# EAGLE design ROB v2 (EAGLE 9.6.2)
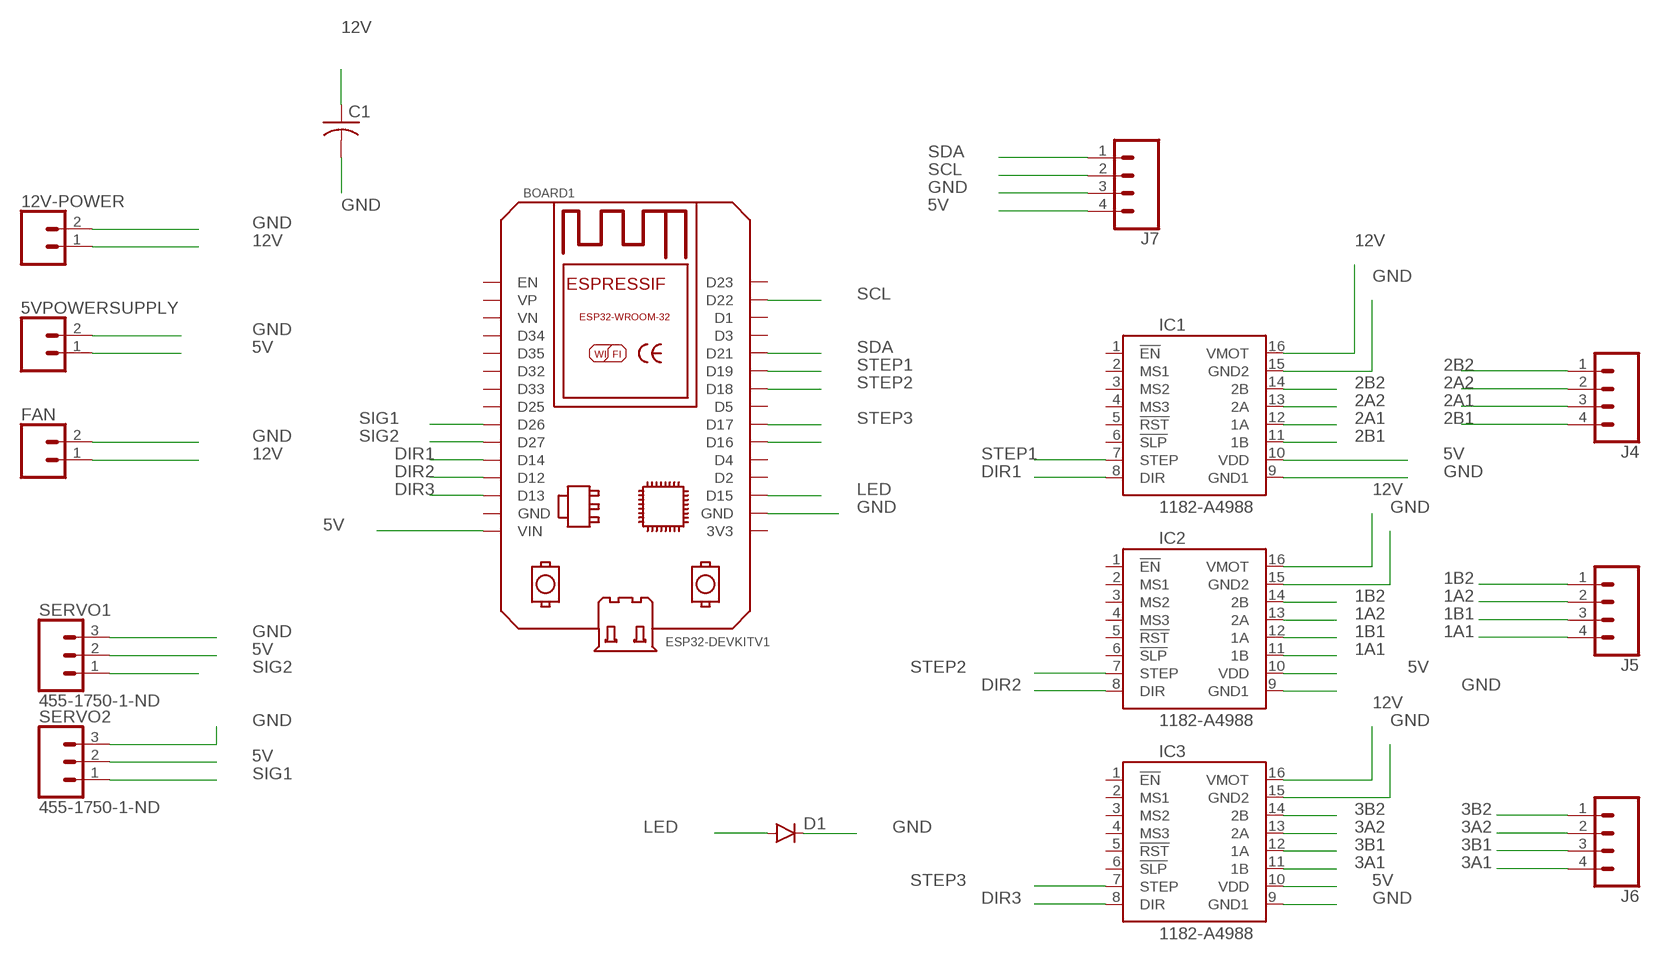
[diagram p0: schematic, sheet 1]

## Parts
5VPOWERSUPPLY  CONN_02  [1X02]
12V-POWER  CONN_02  [1X02]
BOARD1  ESP32DEVKITV1  [ESP32-DEVKITV1]
C1  C-US050-075X075  [C050-075X075]
D1  DIODE  [DIODE-1N4001-KIT]
FAN  CONN_02  [1X02]
IC1  1182-A4988  [A4988]
IC2  1182-A4988  [A4988]
IC3  1182-A4988  [A4988]
J4  CONN_04LONGPADS  [1X04_LONGPADS]
J5  CONN_04LONGPADS  [1X04_LONGPADS]
J6  CONN_04LONGPADS  [1X04_LONGPADS]
J7  CONN_04LOCK  [1X04_LOCK]
SERVO1  455-1750-1-ND  CONN_03  [1X03]
SERVO2  455-1750-1-ND  CONN_03  [1X03]

## Nets
1A1: IC2.11(1B) J5.4
1A2: IC2.13(2A) J5.2
1B1: IC2.12(1A) J5.3
1B2: IC2.14(2B) J5.1
2A1: IC1.12(1A) J4.3
2A2: IC1.13(2A) J4.2
2B1: IC1.11(1B) J4.4
2B2: IC1.14(2B) J4.1
3A1: IC3.11(1B) J6.4
3A2: IC3.13(2A) J6.2
3B1: IC3.12(1A) J6.3
3B2: IC3.14(2B) J6.1
5V: 5VPOWERSUPPLY.1 BOARD1.VIN IC1.10(VDD) IC2.10(VDD) IC3.10(VDD) J7.4 SERVO1.2 SERVO2.2
12V: 12V-POWER.1 C1.1 FAN.1 IC1.16(VMOT) IC2.16(VMOT) IC3.16(VMOT)
DIR1: BOARD1.D14 IC1.8(DIR)
DIR2: BOARD1.D12 IC2.8(DIR)
DIR3: BOARD1.D13 IC3.8(DIR)
GND: 5VPOWERSUPPLY.2 12V-POWER.2 BOARD1.GND@1(GND) C1.2 D1.C FAN.2 IC1.9(GND1) IC1.15(GND2) IC2.9(GND1) IC2.15(GND2) IC3.9(GND1) IC3.15(GND2) J7.3 SERVO1.3 SERVO2.3
LED: BOARD1.D15 D1.A
N$3: BOARD1.D16
SCL: BOARD1.D22 J7.2
SDA: BOARD1.D21 J7.1
SIG1: BOARD1.D26 SERVO2.1
SIG2: BOARD1.D27 SERVO1.1
STEP1: BOARD1.D19 IC1.7(STEP)
STEP2: BOARD1.D18 IC2.7(STEP)
STEP3: BOARD1.D17 IC3.7(STEP)
Unconnected: BOARD1.3V3 BOARD1.D1 BOARD1.D2 BOARD1.D3 BOARD1.D4 BOARD1.D5 BOARD1.D23 BOARD1.D25 BOARD1.D32 BOARD1.D33 BOARD1.D34 BOARD1.D35 BOARD1.EN BOARD1.GND BOARD1.VN BOARD1.VP IC1.1(!EN) IC1.2(MS1) IC1.3(MS2) IC1.4(MS3) IC1.5(!RST) IC1.6(!SLP) IC2.1(!EN) IC2.2(MS1) IC2.3(MS2) IC2.4(MS3) IC2.5(!RST) IC2.6(!SLP) IC3.1(!EN) IC3.2(MS1) IC3.3(MS2) IC3.4(MS3) IC3.5(!RST) IC3.6(!SLP)

## Library data of the parts
5VPOWERSUPPLY 12V-POWER FAN = SparkFun-Connectors:CONN_02: Multi connection point. Often used as Generic Header-pin footprint for 0.1 inch spaced/style header connections On any of the 0.1 inch spaced packages, you can populate with these: Break Away Headers - Straight <https://www.sparkfun.com/products/116> (PRT-00116) Break Away Male Headers - Right Angle <https://www.sparkfun.com/products/553> (PRT-00553) Female Headers <https://www.sparkfun.com/products/115> (PRT-00115) Break Away Headers - Machine Pin <https://www.sparkfun.com/products/117> (PRT-00117) Break Away Female Headers - Swiss Machine Pin <https://www.sparkfun.com/products/743> (PRT-00743) For SCREWTERMINALS and SPRING TERMINALS visit here: Screw Terimnals on SparkFun.com <https://www.sparkfun.com/search/results?term=Screw+Terminals> (5mm/3.5mm/2.54mm spacing) This device is also useful as a general connection point to wire up your design to another part of your project. Our various solder wires solder well into these plated through hole pads. Hook-Up Wire - Assortment (Stranded, 22 AWG) <https://www.sparkfun.com/products/11375> (PRT-11375) Hook-Up Wire - Assortment (Solid Core, 22 AWG) <https://www.sparkfun.com/products/11367> (PRT-11367) View the entire wire category on our website here <https://www.sparkfun.com/categories/141> Special notes: Molex polarized connector foot print use with: PRT-08233 with associated crimp pins and housings. 2.54_SCREWTERM for use with PRT-10571. 3.5mm Screw Terminal footprints for PRT-08084 5mm Screw Terminal footprints for use with PRT-08432
BOARD1 = ESP32-DEVKITV1:ESP32DEVKITV1: https://github.com/shridattdudhat
C1 = BeagleBone_Black_Wireless:C-US: CAPACITOR, American symbol
D1 = BeagleBone_Blue_R3:DIODE: Diode These are standard reverse protection diodes and small signal diodes. SMA package can handle up to about 1A. SOD-323 can handle about 200mA. What the SOD-323 package when ordering, there are some mfgs out there that are 5-pin packages.
IC1-IC3 = pololu-stepper-driver:1182-A4988: A4988 Stepper Motor Driver Carrier #1182 A4988 Stepper Motor Driver Carrier <https://www.pololu.com/product/1182> in Japan, Suzaku Lab. Ltd. <https://suzakugiken.jp/> #1182 A4988ステッピングモータドライバ <https://szc.jp/po1182>
J4-J7 = SparkFun-Connectors:CONN_04: Multi connection point. Often used as Generic Header-pin footprint for 0.1 inch spaced/style header connections On any of the 0.1 inch spaced packages, you can populate with these: Break Away Headers - Straight <https://www.sparkfun.com/products/116> (PRT-00116) Break Away Male Headers - Right Angle <https://www.sparkfun.com/products/553> (PRT-00553) Female Headers <https://www.sparkfun.com/products/115> (PRT-00115) Break Away Headers - Machine Pin <https://www.sparkfun.com/products/117> (PRT-00117) Break Away Female Headers - Swiss Machine Pin <https://www.sparkfun.com/products/743> (PRT-00743) For SCREWTERMINALS and SPRING TERMINALS visit here: Screw Terimnals on SparkFun.com <https://www.sparkfun.com/search/results?term=Screw+Terminals> (5mm/3.5mm/2.54mm spacing) This device is also useful as a general connection point to wire up your design to another part of your project. Our various solder wires solder well into these plated through hole pads. Hook-Up Wire - Assortment (Stranded, 22 AWG) <https://www.sparkfun.com/products/11375> (PRT-11375) Hook-Up Wire - Assortment (Solid Core, 22 AWG) <https://www.sparkfun.com/products/11367> (PRT-11367) View the entire wire category on our website here <https://www.sparkfun.com/categories/141> Special notes: Molex polarized connector foot print use with SKU : PRT-08231 with associated crimp pins and housings. 1MM SMD Version SKU: PRT-10208; PROD_ID: CONN-09696
SERVO1 SERVO2 = SparkFun-Connectors:CONN_03: Multi connection point. Often used as Generic Header-pin footprint for 0.1 inch spaced/style header connections On any of the 0.1 inch spaced packages, you can populate with these: Break Away Headers - Straight <https://www.sparkfun.com/products/116> (PRT-00116) Break Away Male Headers - Right Angle <https://www.sparkfun.com/products/553> (PRT-00553) Female Headers <https://www.sparkfun.com/products/115> (PRT-00115) Break Away Headers - Machine Pin <https://www.sparkfun.com/products/117> (PRT-00117) Break Away Female Headers - Swiss Machine Pin <https://www.sparkfun.com/products/743> (PRT-00743) Stackable Header - 3 Pin (Female, 0.1") <https://www.sparkfun.com/products/13875> (PRT-13875) For SCREWTERMINALS and SPRING TERMINALS visit here: Screw Terimnals on SparkFun.com <https://www.sparkfun.com/search/results?term=Screw+Terminals> (5mm/3.5mm/2.54mm spacing) This device is also useful as a general connection point to wire up your design to another part of your project. Our various solder wires solder well into these plated through hole pads. Hook-Up Wire - Assortment (Stranded, 22 AWG) <https://www.sparkfun.com/products/11375> (PRT-11375) Hook-Up Wire - Assortment (Solid Core, 22 AWG) <https://www.sparkfun.com/products/11367> (PRT-11367) View the entire wire category on our website here <https://www.sparkfun.com/categories/141> Special notes: Molex polarized connector foot print use with SKU : PRT-08232 with associated crimp pins and housings.; PROD_ID: XXX-00000

## Board
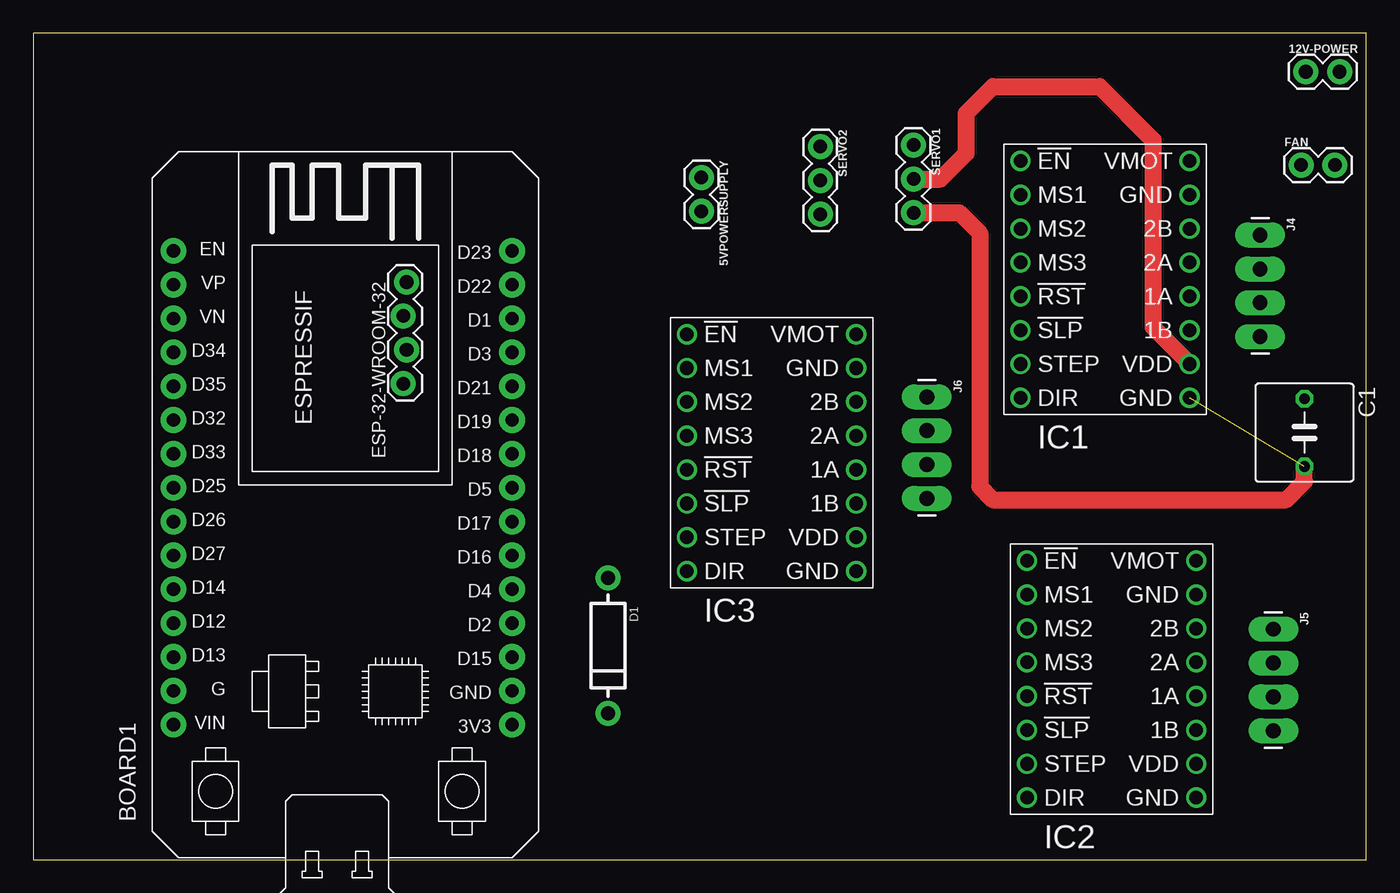
[diagram p1: board, top side]
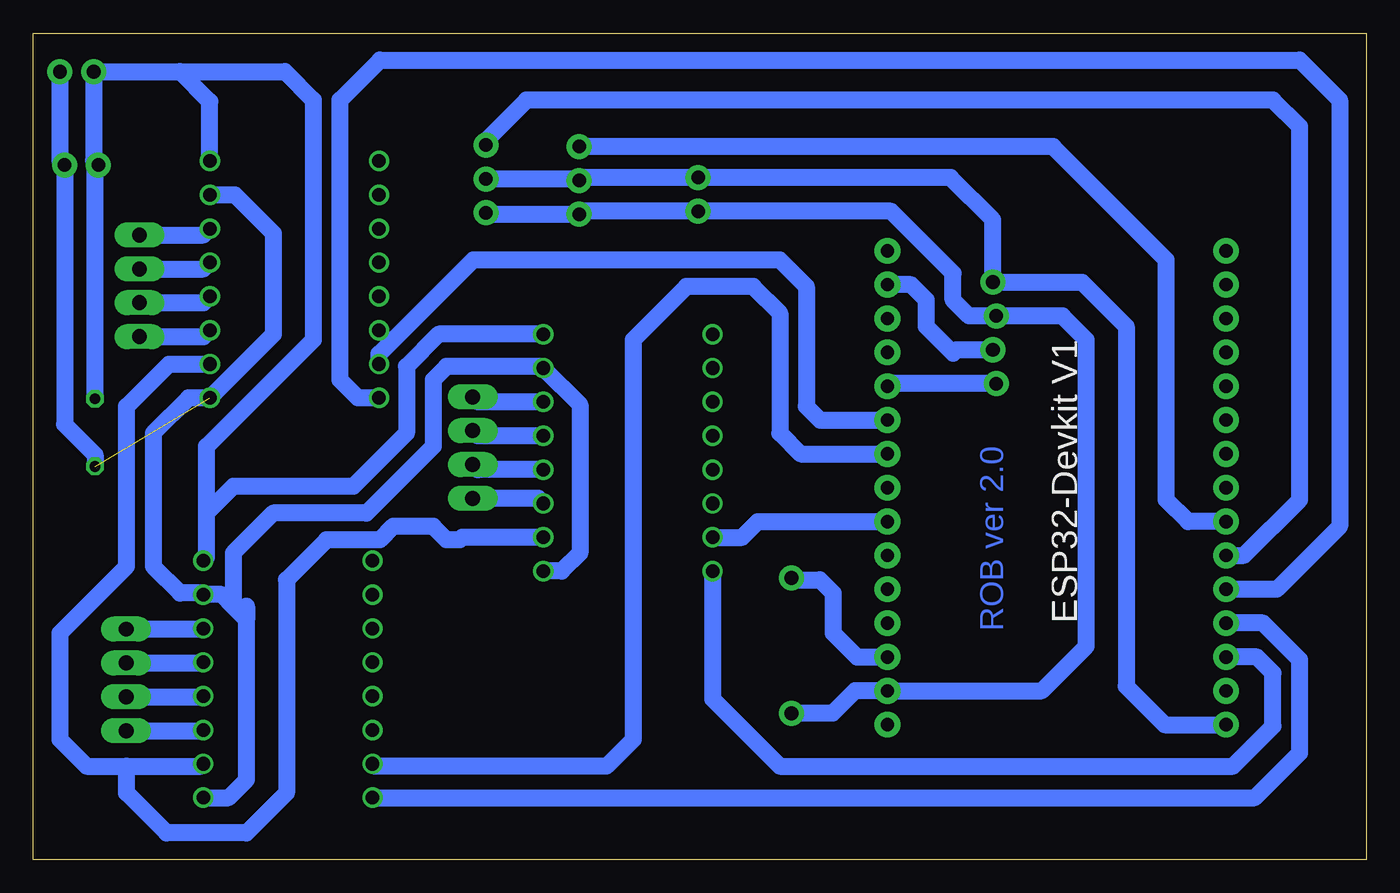
[diagram p2: board, bottom side, seen from below]

Size 100 x 62 mm. Coordinates in mm from the lower left corner, seen from the top.
Outline: 0,0 100,0 100,62 0,62 0,0
Copper layers (1*16): Top 0.035mm / dielectric 1.5mm / Bottom 0.035mm
Design rules "default": minimum track width 6mil, minimum drill 0.35mm, track to track 6mil, track to pad 6mil, pad to pad 6mil, via to via 6mil, smd to smd 6mil, copper to edge 40mil, drill to drill 6mil, minimum pad ring 10mil, minimum via ring 8mil, stop-mask expansion 4mil, vias tented up to drill 0mil, thermal gap 10mil

### Footprints (pad centres in the part's own frame; a part is rotated, then mirrored left to right if it is on the bottom)
1X02 = drill 1.016 pad 1.88: 1 0,0; 2 2.54,0
ESP32-DEVKITV1 = drill 1 pad 1.93: 3V3 0,0; D1 30.48,0; D2 7.62,0; D3 27.94,0; D4 10.16,0; D5 17.78,0; D12 7.62,25.4; D13 5.08,25.4; D14 10.16,25.4; D15 5.08,0; D16 12.7,0; D17 15.24,0; D18 20.32,0; D19 22.86,0; D21 25.4,0; D22 33.02,0; D23 35.56,0; D25 17.78,25.4; D26 15.24,25.4; D27 12.7,25.4; D32 22.86,25.4; D33 20.32,25.4; D34 27.94,25.4; D35 25.4,25.4; EN 35.56,25.4; GND 2.54,25.4; GND@1 2.54,0; VIN 0,25.4; VN 30.48,25.4; VP 33.02,25.4
C050-075X075 = drill 0.813 octagon: 1 -2.54,0; 2 2.54,0
DIODE-1N4001-KIT = drill 1.016 pad 1.88: A -5.08,0; C 5.08,0
A4988 = drill 1.016: 1 -6.35,8.89; 2 -6.35,6.35; 3 -6.35,3.81; 4 -6.35,1.27; 5 -6.35,-1.27; 6 -6.35,-3.81; 7 -6.35,-6.35; 8 -6.35,-8.89; 9 6.35,-8.89; 10 6.35,-6.35; 11 6.35,-3.81; 12 6.35,-1.27; 13 6.35,1.27; 14 6.35,3.81; 15 6.35,6.35; 16 6.35,8.89
1X04_LONGPADS = drill 1.118 pad 1.88 long: 1 0,0; 2 2.54,0; 3 5.08,0; 4 7.62,0
1X04_LOCK = drill 1.016 pad 1.88: 1 0,0.127; 2 2.54,-0.127; 3 5.08,0.127; 4 7.62,-0.127
1X03 = drill 1.016 pad 1.88: 1 0,0; 2 2.54,0; 3 5.08,0

### Placement (x,y rotation side)
5VPOWERSUPPLY  50.12,51.18 270 top
12V-POWER  95.47,59.12 0 top
BOARD1  35.92,10.12 90 top
C1  95.37,32.04 270 top
D1  43.12,16.05 270 top
FAN  95.12,52.12 0 top
IC1  80.41,43.53 0 top
IC2  80.9,13.53 0 top
IC3  55.39,30.53 0 top
J4  92.04,46.86 270 top
J5  93.04,17.29 270 top
J6  67.04,34.72 270 top
J7  27.88,35.71 90 top
SERVO1  66.04,53.61 270 top
SERVO2  59.04,53.5 270 top

### Tracks (layer width: path | path; a pad name or v marks a point on that pad's centre or on a via)
1A1
  Bottom 1.27: IC2.11 87.3,9.67 J5.4
1A2
  Bottom 1.27: IC2.13 87.3,14.75 J5.2
1B1
  Bottom 1.27: J5.3 87.3,12.21 IC2.12
1B2
  Bottom 1.27: IC2.14 87.3,17.29 J5.1
2A1
  Bottom 1.27: J4.3 87.24,41.78 IC1.12
2A2
  Bottom 1.27: IC1.13 87.24,44.32 J4.2
2B1
  Bottom 1.27: J4.4 87.24,39.24 IC1.11
2B2
  Bottom 1.27: IC1.14 87.24,46.86 J4.1
3A1
  Bottom 1.27: IC3.11 62.12,27.1 J6.4
3A2
  Bottom 1.27: IC3.13 66.66,31.8 J6.2
3B1
  Bottom 1.27: IC3.12 66.66,29.26 J6.3
3B2
  Bottom 1.27: IC3.14 66.66,34.34 J6.1
5V
  Top 1.27: SERVO1.2 68.07,51.07 70,53 70,56 72,58 80,58 84,54 84,39.94 IC1.10
  Bottom 1.27: 93,7 96,7 98,9 98,17 93,22 93,34 89.82,37.18 IC1.10 | 93,7 87.43,7 IC2.10 | IC3.10 67.82,24.18 68,24 69,24 70,25 73,25 74,24 78,24 81,21 81,5 84,2 90,2 93,5 93,7 | SERVO1.2 59.15,51.07 SERVO2.2 58.82,51.18 5VPOWERSUPPLY.1 31.18,51.18 28.01,48.01 J7.4 21.33,43.33 18,40 18,13 15.12,10.12 BOARD1.VIN
12V
  Bottom 1.27: 89,59.12 12V-POWER.1 95.47,52.47 FAN.1 95.37,51.87 C1.1 | IC1.16 86.76,56.88 89,59.12 | IC2.16 87,22.67 87,26 | 87,26 87,31 79,39 79,57 81.12,59.12 89,59.12 | IC3.16 69.58,39.42 72,37 72,32 76,28 85,28 87,26
DIR1
  Bottom 1.27: IC1.8 75.64,34.64 77,36 77,57 74,60 5,60 2,57 2,25 6.72,20.28 BOARD1.D14
DIR2
  Bottom 1.27: IC2.8 8.36,4.64 5,8 5,15 7.74,17.74 BOARD1.D12
DIR3
  Bottom 1.27: IC3.8 49.04,12.04 44,7 10,7 7,10 7,14 8.2,15.2 BOARD1.D13
GND  (1 unrouted)
  Top 1.27: SERVO1.3 69.47,48.53 71,47 71,28 72,27 94,27 95.37,28.37 C1.2
  Bottom 1.27: IC2.9 85.36,4.64 84,6 84,18 | 84,18 85,19 | 85,19 85.88,19.88 IC2.15 87.37,20 89,20 91,22 91,32 88.36,34.64 IC1.9 82,39.4 82,47 84.88,49.88 IC1.15 | 84,19 84,18 | 85,19 85,23 82,26 75,26 70,31 70,36 69,37 61.86,37 IC3.15 59,34.14 59,23 60.36,21.64 IC3.9 | 12V-POWER.2 98.01,52.47 FAN.2 97.66,32.66 95.37,30.37 C1.2 | D1.C 40.03,10.97 38.34,12.66 BOARD1.GND@1 24.34,12.66 21,16 21,39 22.79,40.79 J7.3 29.79,40.79 31,42 31,44 35.64,48.64 5VPOWERSUPPLY.2 58.82,48.64 SERVO2.3 65.93,48.42 SERVO1.3
LED
  Bottom 1.27: D1.A 42.99,21 41,21 40,20 40,17 38.2,15.2 BOARD1.D15
SCL
  Bottom 1.27: J7.2 30.75,38.25 31,38 33,40 33,42 34.14,43.14 BOARD1.D22
SDA
  Bottom 1.27: J7.1 35.73,35.71 BOARD1.D21
SIG1
  Bottom 1.27: BOARD1.D26 13.36,25.36 15,27 15,45 23.5,53.5 SERVO2.1
SIG2
  Bottom 1.27: BOARD1.D27 9.18,22.82 5,27 5,55 7,57 63,57 66.04,53.96 SERVO1.1
STEP1
  Bottom 1.27: IC1.7 74.06,37.94 67,45 44,45 42,43 42,34 40.98,32.98 BOARD1.D19
STEP2
  Bottom 1.27: IC2.7 74.37,7 57,7 55,9 55,39 51,43 46,43 44,41 44,32 42.44,30.44 BOARD1.D18
STEP3
  Bottom 1.27: IC3.7 46.82,24.18 45.64,25.36 BOARD1.D17

### Text on the board
Bottom: ROB ver 2.0